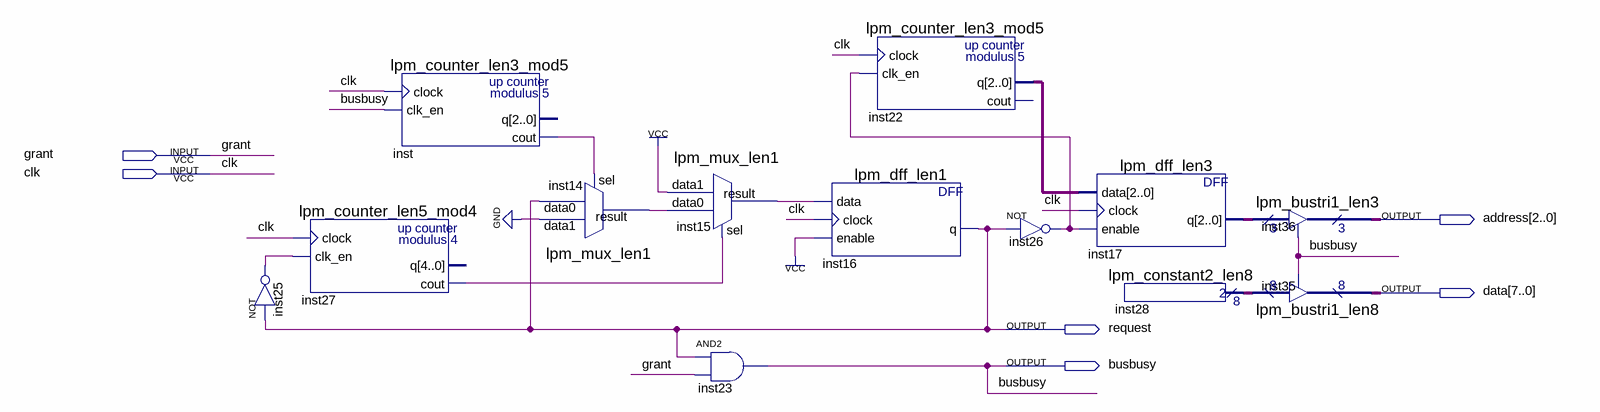
[diagram p0: schematic sheet]
// Quartus schematic Master3.bdf as structural Verilog: 13 symbols, 6 pins
module Master3 (
  input  grant,
  input  clk,
  output [2:0] address,
  output [7:0] data,
  output request,
  output busbusy
);

  wire inst14_result, inst15_result, inst25_out, inst26_out, inst27_cout, inst_cout;
  wire [2:0] inst17_q, inst22_q;
  wire [7:0] inst28_result;

  lpm_counter_len5_mod4 inst27 (.clock(clk), .clk_en(inst25_out), .cout(inst27_cout));  // open: q
  not inst25 (inst25_out, request);
  lpm_counter_len3_mod5 inst (.clock(clk), .clk_en(busbusy), .cout(inst_cout));  // open: q
  lpm_mux_len1 inst14 (.data1(1'b0), .data0(request), .sel(inst_cout), .result(inst14_result));
  lpm_mux_len1 inst15 (.data1(1'b1), .data0(inst14_result), .sel(inst27_cout), .result(inst15_result));
  and inst23 (busbusy, request, grant);
  lpm_counter_len3_mod5 inst22 (.clock(clk), .clk_en(inst26_out), .q(inst22_q));  // open: cout
  lpm_dff_len1 inst16 (.data(inst15_result), .clock(clk), .enable(1'b1), .q(request));
  not inst26 (inst26_out, request);
  lpm_dff_len3 inst17 (.data(inst22_q), .clock(clk), .enable(inst26_out), .q(inst17_q));
  lpm_constant2_len8 inst28 (.result(inst28_result));
  lpm_bustri1_len3 inst36 (.enabledt(busbusy), .data(inst17_q), .tridata(address));
  lpm_bustri1_len8 inst35 (.enabledt(busbusy), .data(inst28_result), .tridata(data));
endmodule
